# Altium schematic sheet [12] - RELAYS.SchDoc
size A4; DocumentNumber: 12; SheetNumber: 12; SheetTotal: 14
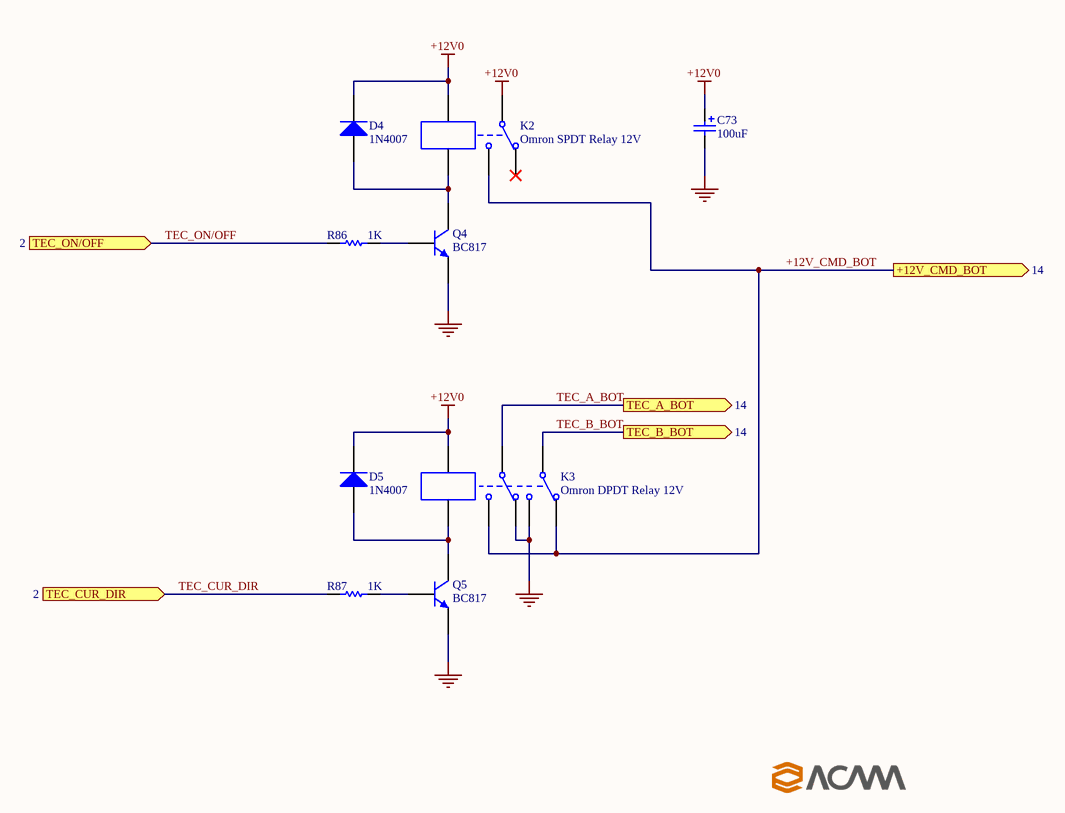
[diagram p0: [12] - RELAYS.SchDoc]

## Parts
C73  100uF  [WCAP-ASLI_6.3x5.5]
D4  1N4007  [SMA]
D5  1N4007  [SMA]
K2  Omron SPDT Relay 12V  [RELAY_SPDT]
K3  Omron DPDT Relay 12V  [RELAY_DPDT]
Q4  BC817  [SOT23]
Q5  BC817  [SOT23]
R86  1K  [0402_R]
R87  1K  [0402_R]

## Ports
+12V_CMD_BOT (out, see 14), TEC_A_BOT (out, see 14), TEC_B_BOT (out, see 14), TEC_CUR_DIR (in, see 2), TEC_ON/OFF (in, see 2)

## Nets
+12V0: C73.1 D4.2(K) D5.2(K) K2.1(Coil-A) K2.4(COM) K3.1(Coil-A)
GND: C73.2 K3.2(Pole_1_NC) K3.5(Pole_2_NO) Q4.2(E) Q5.2(E)
+12V_CMD_BOT: K2.3(NO) K3.4(Pole_1_NO) K3.7(Pole_2_NC) ; port +12V_CMD_BOT
TEC_A_BOT: K3.3(Pole_1_COM) ; port TEC_A_BOT
TEC_B_BOT: K3.6(Pole_2_COM) ; port TEC_B_BOT
TEC_CUR_DIR: R87.1 ; port TEC_CUR_DIR
TEC_ON/OFF: R86.1 ; port TEC_ON/OFF
NetD4_1: D4.1(A) K2.5(Coil-B) Q4.3(C)
NetD5_1: D5.1(A) K3.8(Coil-B) Q5.3(C)
NetQ4_1: Q4.1(B) R86.2
NetQ5_1: Q5.1(B) R87.2

Not connected (* = marked no-connect by the designer): K2 2(NC)*

## Library data of the parts
C73 = Cap Aluminium Electrolytic: Aluminium Electrolytic Capacitor; RATED_VOLTAGE: 16V; Value: 100uF; Manufacturer Part Num: *
D4 D5 = Diode: Value: 1N4007; Manufacturer Part Num: 1N4007
K2 = Relay-SPDT: Omron Single-Pole Dual-Throw Relay; Manufacturer Part Num: G2R-1-DC12; Value: Omron SPDT Relay 12V
K3 = Relay-DPDT: Omron Dual-Pole Dual-Throw Relay; Manufacturer Part Num: G2R-2-DC12; Value: Omron DPDT Relay 12V
Q4 Q5 = Transistor NPN: NPN General Purpose Transistor; Value: BC817; Manufacturer Part Num: *
R86 R87 = Res SMD: SMD Resistor; Tolerance: 5%; Value: 1K; Manufacturer Part Num: *